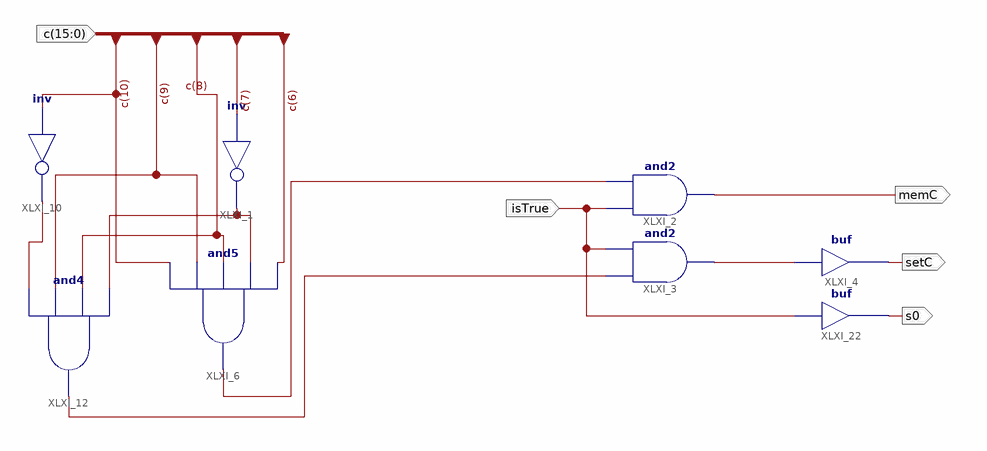
[diagram p0: schematic sheet 1]
// Xilinx ISE schematic LCA.sch (spartan3e) as structural Verilog: 8 symbols, 5 ports
module LCA (
  input  isTrue,
  input  [15:0] c,
  output memC,
  output setC,
  output s0
);

  wire XLXN_23, XLXN_24, XLXN_27, XLXN_35, XLXN_37;

  not XLXI_1 (XLXN_23, c[7]);
  and XLXI_2 (memC, isTrue, XLXN_24);
  and XLXI_3 (XLXN_27, XLXN_37, isTrue);
  buf XLXI_4 (setC, XLXN_27);
  not XLXI_10 (XLXN_35, c[10]);
  and XLXI_6 (XLXN_24, c[10], c[9], c[8], XLXN_23, c[6]);
  and XLXI_12 (XLXN_37, XLXN_35, c[9], c[8], XLXN_23);
  buf XLXI_22 (s0, isTrue);
endmodule
